# Altium project remote_usb.PrjPcb
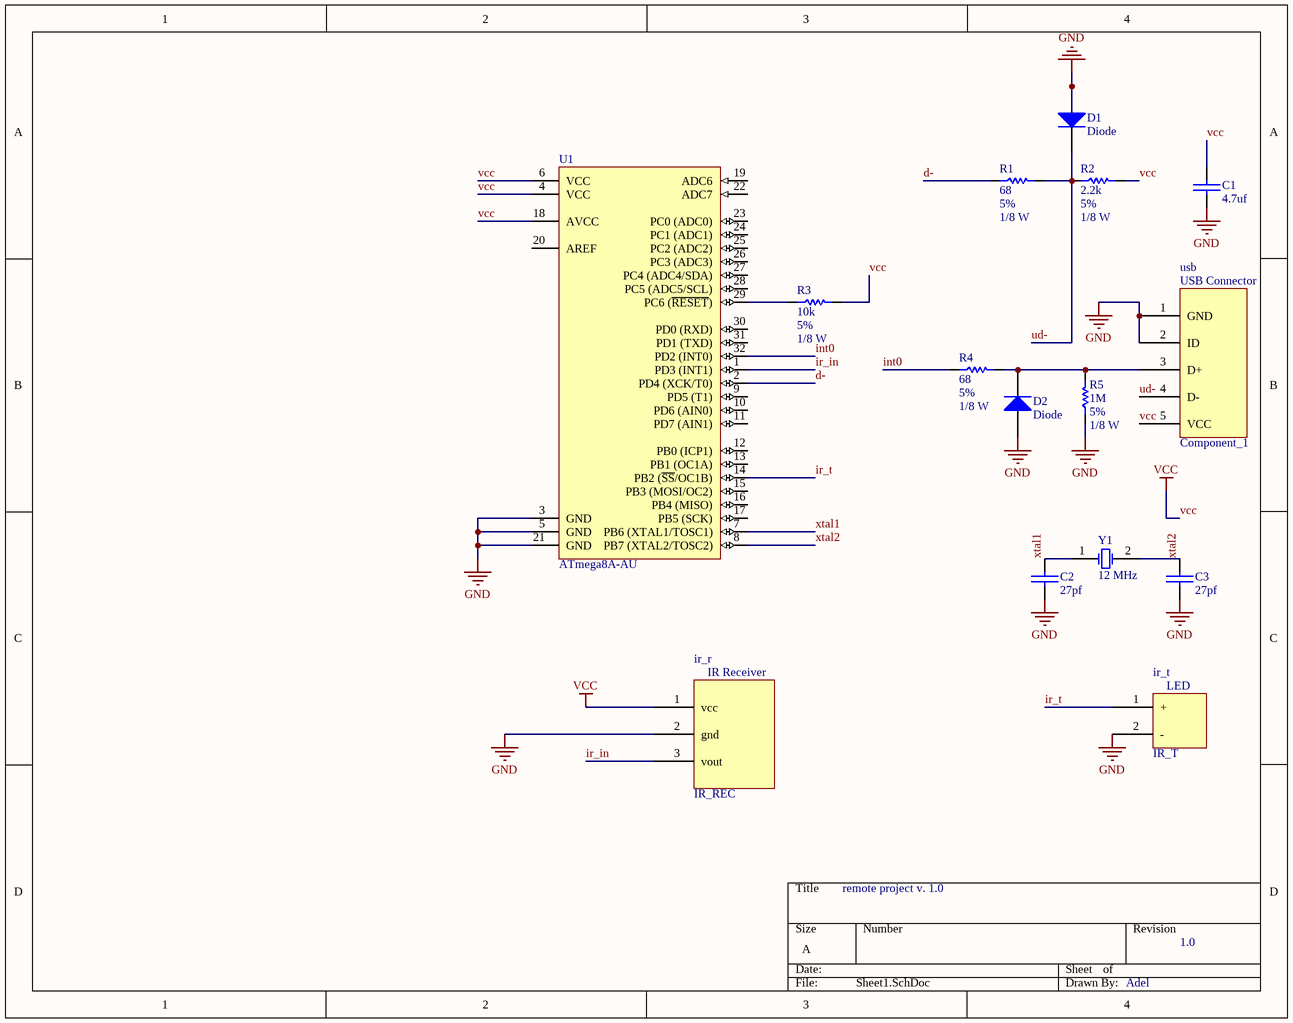
[diagram p0: Sheet1.SchDoc]
1 sheet, 15 parts. Net scope: global (net labels, ports and power ports of the same name join across sheets).
Board file: v1.PcbDoc

## Sheet Sheet1.SchDoc
size A

### Parts
C1  4.7uf  [SMD_CAP_0805]
C2  27pf  [SMD_CAP_0805]
C3  27pf  [SMD_CAP_0805]
D1  Diode  [zener 2]
D2  Diode  [zener 2]
ir_r  IR_REC  [IR Receiver]
ir_t  IR_T  [Diode]
R1  Tolerance: 5%  Power: 1/8 W  [RES 0805 (2012X06L)]  (hidden comment: 68)
R2  Tolerance: 5%  Power: 1/8 W  [RES 0805 (2012X06L)]  (hidden comment: 2.2k)
R3  Tolerance: 5%  Power: 1/8 W  [RES 0805 (2012X06L)]  (hidden comment: 10k)
R4  Tolerance: 5%  Power: 1/8 W  [RES 0805 (2012X06L)]  (hidden comment: 68)
R5  Tolerance: 5%  Power: 1/8 W  [RES 0805 (2012X06L)]  (hidden comment: 1M)
U1  ATmega8A-AU  [32A_N]
usb  Component_1  [USB Edge]
Y1  12 MHz  [Crystal SMD]

### Nets
GND: C1.2(-) C2.2(-) C3.2(-) D1.1(A) D2.1(A) ir_r.2(gnd) ir_t.2(-) R5.1 U1.3(GND) U1.5(GND) U1.21(GND) usb.1(GND) usb.2(ID)
vcc: C1.1(+) ir_r.1(vcc) R2.2 R3.2 U1.4(VCC) U1.6(VCC) U1.18(AVCC) usb.5(VCC)
d-: R1.1 U1.2(PD4_(XCK/T0))
int0: R4.1 U1.32(PD2_(INT0))
ir_in: ir_r.3(vout) U1.1(PD3_(INT1))
ir_t: ir_t.1(+) U1.14(PB2_(~{SS}/OC1B))
ud-: D1.2(K) R1.2 R2.1 usb.4(D-)
xtal1: C2.1(+) U1.7(PB6_(XTAL1/TOSC1)) Y1.1(OSC1)
xtal2: C3.1(+) U1.8(PB7_(XTAL2/TOSC2)) Y1.2(OSC2)
NetD2_2: D2.2(K) R4.2 R5.2 usb.3(D+)
NetR3_1: R3.1 U1.29(PC6_(~{RESET}))

Not connected (* = marked no-connect by the designer): U1 9(PD5_(T1)) 10(PD6_(AIN0)) 11(PD7_(AIN1)) 12(PB0_(ICP1)) 13(PB1_(OC1A)) 15(PB3_(MOSI/OC2)) 16(PB4_(MISO)) 17(PB5_(SCK)) 19(ADC6) 20(AREF) 22(ADC7) 23(PC0_(ADC0)) 24(PC1_(ADC1)) 25(PC2_(ADC2)) 26(PC3_(ADC3)) 27(PC4_(ADC4/SDA)) 28(PC5_(ADC5/SCL)) 30(PD0_(RXD)) 31(PD1_(TXD))

### Notes on the sheet
- remote project v. 1.0
- 1.0
- Adel
- (in symbol Component_1) LED; IR Receiver; USB Connector

### Library data of the parts
C1-C3 = Cap-Bipolar: Bipolar Capacitor; Voltage: 100V; Designer: Saeid Jorablo; Organazation: ControTec; Adding Date: 1387/12/20
  C1: Value: 4.7uf
  C2 C3: Value: 27pf
D1 D2 = Diode: Default Diode; Published: 8-Jun-2000; LatestRevisionDate: 17-Jul-2002; LatestRevisionNote: Re-released for DXP Platform.; PackageVersion: Sep-1996; PackageReference: SMC; Publisher: Altium Limited; PackageDescription: DO-214-AB/SMC; 2 C-Bend Leads; Body 7.9 x 5.9 mm, inc. leads (LxW); Code_JEDEC: DO-214-AB
ir_r ir_t = Component_1
R1-R5 = Resistor
  R1 R4: Value: 68
  R2: Value: 2.2k
  R3: Value: 10k
  R5: Value: 1M
U1 = ATmega8A-AU: 8-bit AVR Microcontroller, 8KB Flash, 512 Bytes EEPROM, 1KB SRAM, 32-pin TQFP, Industrial Grade (-40°C to 85°C); Published: 1-Apr-2010; DatasheetVersion: revC, Jul-2009; PackageVersion: revB, Oct-2001; PackageReference: 32A; Publisher: Altium Limited; PackageDescription: 32-Lead, 7x7x1.0 mm Body, 0.8mm Lead Pitch, Thin Profile Plastic Quad Flat Package (TQFP); Supplier 1: Digi-Key; Supplier Part Number 1: ATMEGA8A-AU-ND; Supplier 2: Farnell; Supplier Part Number 2: 1748532; Supplier 3: Mouser; Supplier Part Number 3: 556-ATMEGA8A-AU; Code_JEDEC: MS-026-ABA; ComponentLink1Description: Manufacturer Link; ComponentLink1URL: http://www.atmel.com/products/avr/default.asp?; ComponentLink2Description: ATmega8A Datasheet; ComponentLink2URL: http://www.atmel.com/dyn/resources/prod_documents/doc8159.pdf; ComponentLink3Description: ATmega8A Summary; ComponentLink3URL: http://www.atmel.com/dyn/resources/prod_documents/8159S.pdf; ComponentLink4Description: Atmel.com Home; ComponentLink4URL: http://www.atmel.com
Y1 = XTAL: XTAL Crystal; Company: E.P.I.L; Design Date: 11/04/2011; Value: 12 MHz